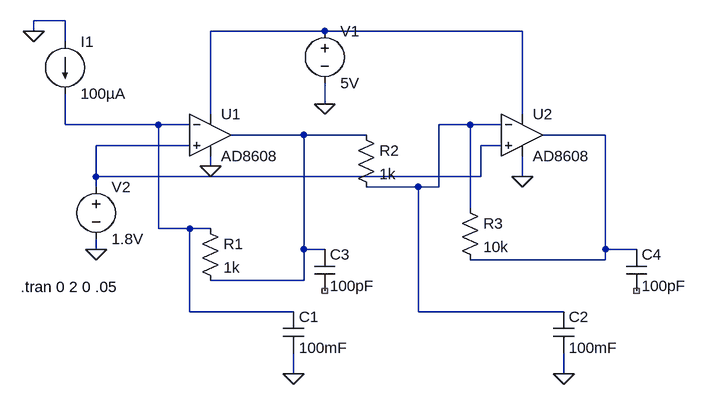
[diagram p0: schematic transimpedance_amp.asc]
transimpedance_amp.asc, the LTspice schematic file:
Version 4
SHEET 1 964 680
WIRE 0 16 -48 16
WIRE -48 32 -48 16
WIRE 400 32 224 32
WIRE 704 32 400 32
WIRE 0 48 0 16
WIRE 400 144 400 112
WIRE 224 160 224 32
WIRE 704 160 704 32
WIRE 0 176 0 128
WIRE 144 176 0 176
WIRE 192 176 144 176
WIRE 624 176 576 176
WIRE 672 176 624 176
WIRE 368 192 256 192
WIRE 464 192 368 192
WIRE 832 192 736 192
WIRE 192 208 48 208
WIRE 672 208 640 208
WIRE 224 240 224 224
WIRE 48 256 48 208
WIRE 640 256 640 208
WIRE 640 256 48 256
WIRE 704 256 704 224
WIRE 48 272 48 256
WIRE 544 272 464 272
WIRE 576 272 576 176
WIRE 576 272 544 272
WIRE 624 304 624 176
WIRE 144 336 144 176
WIRE 192 336 144 336
WIRE 224 336 192 336
WIRE 48 368 48 352
WIRE 368 368 368 192
WIRE 400 368 368 368
WIRE 832 368 832 192
WIRE 880 368 832 368
WIRE 832 384 832 368
WIRE 832 384 624 384
WIRE 368 416 368 368
WIRE 368 416 224 416
WIRE 192 464 192 336
WIRE 352 464 192 464
WIRE 544 464 544 272
WIRE 768 464 544 464
WIRE 352 560 352 528
WIRE 768 560 768 528
FLAG 224 240 0
FLAG 400 144 0
FLAG 704 256 0
FLAG 48 368 0
FLAG -48 32 0
FLAG 352 560 0
FLAG 768 560 0
SYMBOL res 208 320 R0
SYMATTR InstName R1
SYMATTR Value 1k
SYMBOL res 448 176 R0
SYMATTR InstName R2
SYMATTR Value 1k
SYMBOL res 608 288 R0
SYMATTR InstName R3
SYMATTR Value 10k
SYMBOL OpAmps\\AD8608 224 128 R0
SYMATTR InstName U1
SYMBOL OpAmps\\AD8608 704 128 R0
SYMATTR InstName U2
SYMBOL voltage 400 16 R0
WINDOW 123 0 0 Left 0
WINDOW 39 0 0 Left 0
SYMATTR InstName V1
SYMATTR Value 5V
SYMBOL voltage 48 256 R0
WINDOW 123 0 0 Left 0
WINDOW 39 0 0 Left 0
SYMATTR InstName V2
SYMATTR Value 1.8V
SYMBOL current 0 48 R0
WINDOW 123 0 0 Left 0
WINDOW 39 0 0 Left 0
SYMATTR InstName I1
SYMATTR Value 100µA
SYMBOL cap 336 464 R0
SYMATTR InstName C1
SYMATTR Value 100mF
SYMBOL cap 752 464 R0
SYMATTR InstName C2
SYMATTR Value 100mF
SYMBOL cap 384 368 R0
SYMATTR InstName C3
SYMATTR Value 100pF
SYMBOL cap 864 368 R0
SYMATTR InstName C4
SYMATTR Value 100pF
TEXT -68 426 Left 2 !.tran 0 2 0 .05

The netlist it stands for:
* transimpedance_amp.asc
R1 N002 N004 1k
R2 N004 N003 1k
R3 N003 N005 10k
XU1 N006 N002 N001 0 N004 AD8608  ; pins In+ In- V+ V- OUT
XU2 N006 N003 N001 0 N005 AD8608  ; pins In+ In- V+ V- OUT
V1 N001 0 5V
V2 N006 0 1.8V
I1 0 N002 100µA
C1 N002 0 100mF
C2 N003 0 100mF
C3 N004 NC_01 100pF
C4 N005 NC_02 100pF
.tran 0 2 0 .05
.backanno
.end